# Altium schematic sheet CPU_POWER.SchDoc
size A2 portrait; SheetNumber: 18; SheetTotal: 25
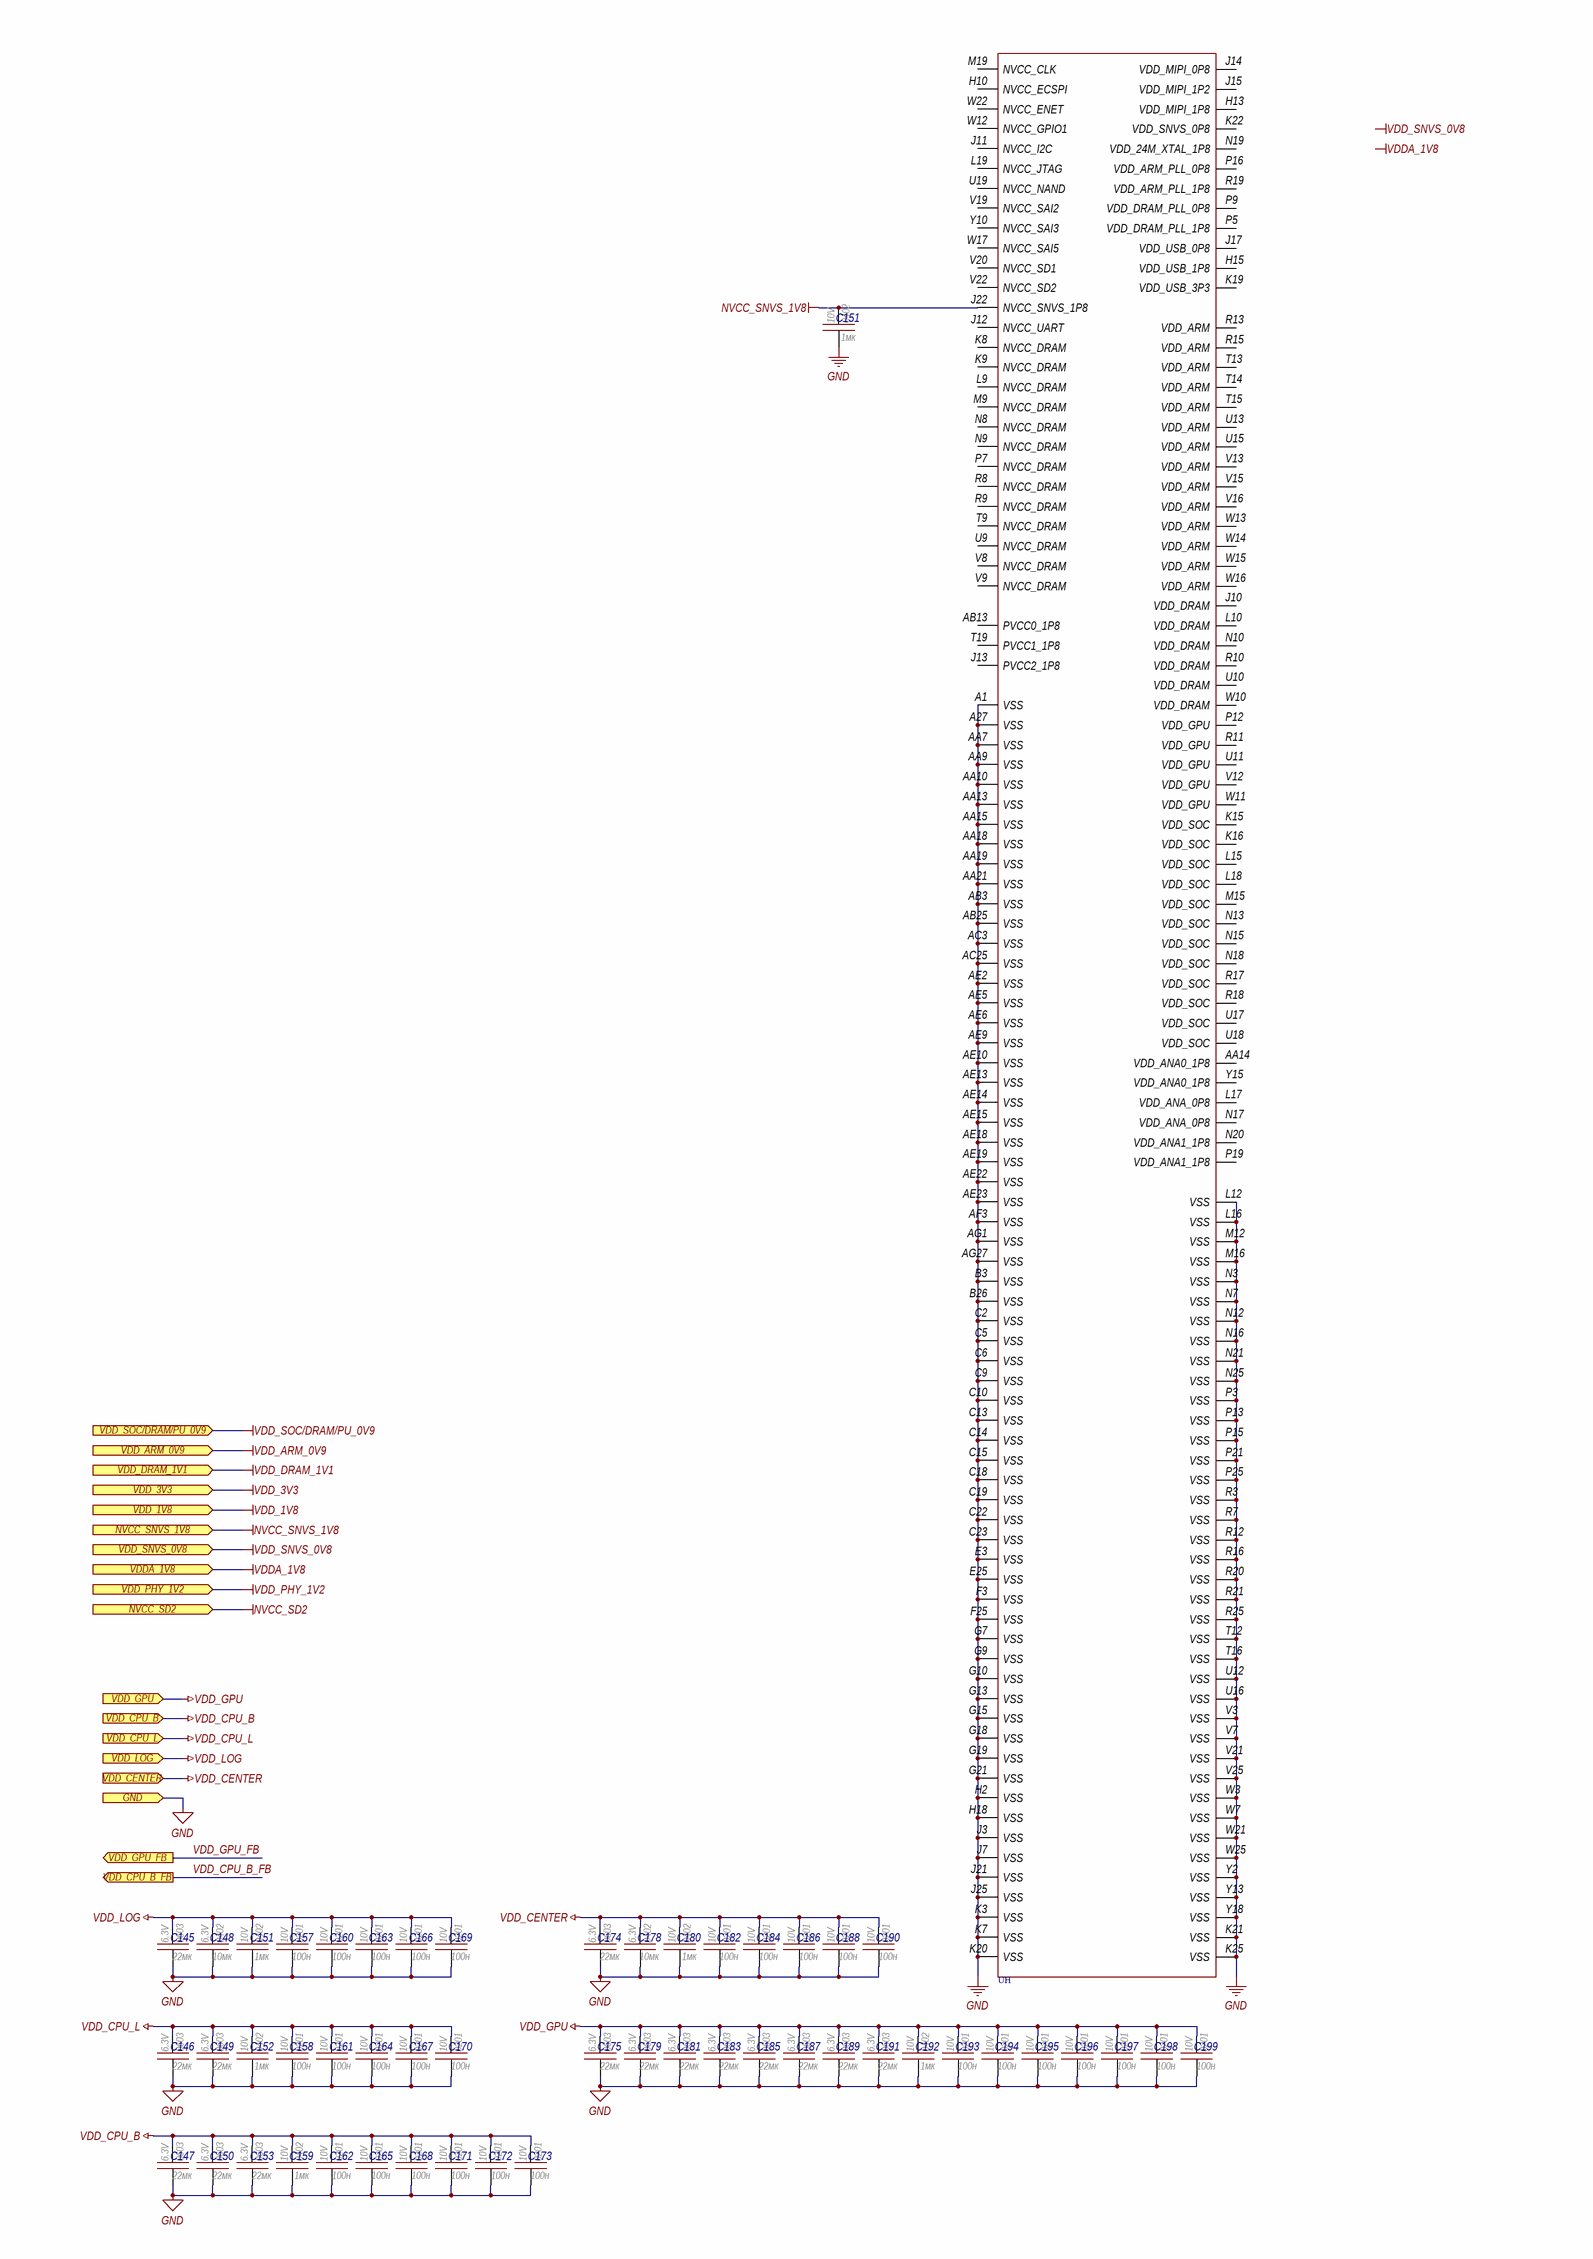
[diagram p0: CPU_POWER.SchDoc]

## Parts
(Parts that share a designator on the sheet are numbered #1, #2 ... from top to bottom, then left to right.)
C145  Значение: 22мк  2) Package: 0603  3) Voltage: 6.3V  [CAPC_1.8x1.0x1.0B_L]  (hidden comment: GRM188R60J226MEA0)
C146  Значение: 22мк  2) Package: 0603  3) Voltage: 6.3V  [CAPC_1.8x1.0x1.0B_L]  (hidden comment: GRM188R60J226MEA0)
C147  Значение: 22мк  2) Package: 0603  3) Voltage: 6.3V  [CAPC_1.8x1.0x1.0B_L]  (hidden comment: GRM188R60J226MEA0)
C148  Значение: 10мк  2) Package: 0402  3) Voltage: 6.3V  [CAPC_1.15x0.65x0.65B_L_Gap-0.25mm]  (hidden comment: GRM155R60J106ME15)
C149  Значение: 22мк  2) Package: 0603  3) Voltage: 6.3V  [CAPC_1.8x1.0x1.0B_L]  (hidden comment: GRM188R60J226MEA0)
C150  Значение: 22мк  2) Package: 0603  3) Voltage: 6.3V  [CAPC_1.8x1.0x1.0B_L]  (hidden comment: GRM188R60J226MEA0)
C151#1  Значение: 1мк  2) Package: 0402  3) Voltage: 10V  [CAPC_1.05x0.55x0.55B_N_SG-0.25_SE-0.05]  (hidden comment: GRM155R61A105KE15D)
C151#2  Значение: 1мк  2) Package: 0402  3) Voltage: 10V  [CAPC_1.05x0.55x0.55B_N_SG-0.25_SE-0.05]  (hidden comment: GRM155R61A105KE15D)
C152  Значение: 1мк  2) Package: 0402  3) Voltage: 10V  [CAPC_1.05x0.55x0.55B_N_SG-0.25_SE-0.05]  (hidden comment: GRM155R61A105KE15D)
C153  Значение: 22мк  2) Package: 0603  3) Voltage: 6.3V  [CAPC_1.8x1.0x1.0B_L]  (hidden comment: GRM188R60J226MEA0)
C157  Значение: 100н  2) Package: 0201  3) Voltage: 10V  [CAPC_0.63x0.33x0.33B_LL_SG-0.25_SE-0.05]  (hidden comment: GRM033R61A104KE15)
C158  Значение: 100н  2) Package: 0201  3) Voltage: 10V  [CAPC_0.63x0.33x0.33B_LL_SG-0.25_SE-0.05]  (hidden comment: GRM033R61A104KE15)
C159  Значение: 1мк  2) Package: 0402  3) Voltage: 10V  [CAPC_1.05x0.55x0.55B_N_SG-0.25_SE-0.05]  (hidden comment: GRM155R61A105KE15D)
C160  Значение: 100н  2) Package: 0201  3) Voltage: 10V  [CAPC_0.63x0.33x0.33B_LL_SG-0.25_SE-0.05]  (hidden comment: GRM033R61A104KE15)
C161  Значение: 100н  2) Package: 0201  3) Voltage: 10V  [CAPC_0.63x0.33x0.33B_LL_SG-0.25_SE-0.05]  (hidden comment: GRM033R61A104KE15)
C162  Значение: 100н  2) Package: 0201  3) Voltage: 10V  [CAPC_0.63x0.33x0.33B_LL_SG-0.25_SE-0.05]  (hidden comment: GRM033R61A104KE15)
C163  Значение: 100н  2) Package: 0201  3) Voltage: 10V  [CAPC_0.63x0.33x0.33B_LL_SG-0.25_SE-0.05]  (hidden comment: GRM033R61A104KE15)
C164  Значение: 100н  2) Package: 0201  3) Voltage: 10V  [CAPC_0.63x0.33x0.33B_LL_SG-0.25_SE-0.05]  (hidden comment: GRM033R61A104KE15)
C165  Значение: 100н  2) Package: 0201  3) Voltage: 10V  [CAPC_0.63x0.33x0.33B_LL_SG-0.25_SE-0.05]  (hidden comment: GRM033R61A104KE15)
C166  Значение: 100н  2) Package: 0201  3) Voltage: 10V  [CAPC_0.63x0.33x0.33B_LL_SG-0.25_SE-0.05]  (hidden comment: GRM033R61A104KE15)
C167  Значение: 100н  2) Package: 0201  3) Voltage: 10V  [CAPC_0.63x0.33x0.33B_LL_SG-0.25_SE-0.05]  (hidden comment: GRM033R61A104KE15)
C168  Значение: 100н  2) Package: 0201  3) Voltage: 10V  [CAPC_0.63x0.33x0.33B_LL_SG-0.25_SE-0.05]  (hidden comment: GRM033R61A104KE15)
C169  Значение: 100н  2) Package: 0201  3) Voltage: 10V  [CAPC_0.63x0.33x0.33B_LL_SG-0.25_SE-0.05]  (hidden comment: GRM033R61A104KE15)
C170  Значение: 100н  2) Package: 0201  3) Voltage: 10V  [CAPC_0.63x0.33x0.33B_LL_SG-0.25_SE-0.05]  (hidden comment: GRM033R61A104KE15)
C171  Значение: 100н  2) Package: 0201  3) Voltage: 10V  [CAPC_0.63x0.33x0.33B_LL_SG-0.25_SE-0.05]  (hidden comment: GRM033R61A104KE15)
C172  Значение: 100н  2) Package: 0201  3) Voltage: 10V  [CAPC_0.63x0.33x0.33B_LL_SG-0.25_SE-0.05]  (hidden comment: GRM033R61A104KE15)
C173  Значение: 100н  2) Package: 0201  3) Voltage: 10V  [CAPC_0.63x0.33x0.33B_LL_SG-0.25_SE-0.05]  (hidden comment: GRM033R61A104KE15)
C174  Значение: 22мк  2) Package: 0603  3) Voltage: 6.3V  [CAPC_1.8x1.0x1.0B_L]  (hidden comment: GRM188R60J226MEA0)
C175  Значение: 22мк  2) Package: 0603  3) Voltage: 6.3V  [CAPC_1.8x1.0x1.0B_L]  (hidden comment: GRM188R60J226MEA0)
C178  Значение: 10мк  2) Package: 0402  3) Voltage: 6.3V  [CAPC_1.15x0.65x0.65B_L_Gap-0.25mm]  (hidden comment: GRM155R60J106ME15)
C179  Значение: 22мк  2) Package: 0603  3) Voltage: 6.3V  [CAPC_1.8x1.0x1.0B_L]  (hidden comment: GRM188R60J226MEA0)
C180  Значение: 1мк  2) Package: 0402  3) Voltage: 10V  [CAPC_1.05x0.55x0.55B_N_SG-0.25_SE-0.05]  (hidden comment: GRM155R61A105KE15D)
C181  Значение: 22мк  2) Package: 0603  3) Voltage: 6.3V  [CAPC_1.8x1.0x1.0B_L]  (hidden comment: GRM188R60J226MEA0)
C182  Значение: 100н  2) Package: 0201  3) Voltage: 10V  [CAPC_0.63x0.33x0.33B_LL_SG-0.25_SE-0.05]  (hidden comment: GRM033R61A104KE15)
C183  Значение: 22мк  2) Package: 0603  3) Voltage: 6.3V  [CAPC_1.8x1.0x1.0B_L]  (hidden comment: GRM188R60J226MEA0)
C184  Значение: 100н  2) Package: 0201  3) Voltage: 10V  [CAPC_0.63x0.33x0.33B_LL_SG-0.25_SE-0.05]  (hidden comment: GRM033R61A104KE15)
C185  Значение: 22мк  2) Package: 0603  3) Voltage: 6.3V  [CAPC_1.8x1.0x1.0B_L]  (hidden comment: GRM188R60J226MEA0)
C186  Значение: 100н  2) Package: 0201  3) Voltage: 10V  [CAPC_0.63x0.33x0.33B_LL_SG-0.25_SE-0.05]  (hidden comment: GRM033R61A104KE15)
C187  Значение: 22мк  2) Package: 0603  3) Voltage: 6.3V  [CAPC_1.8x1.0x1.0B_L]  (hidden comment: GRM188R60J226MEA0)
C188  Значение: 100н  2) Package: 0201  3) Voltage: 10V  [CAPC_0.63x0.33x0.33B_LL_SG-0.25_SE-0.05]  (hidden comment: GRM033R61A104KE15)
C189  Значение: 22мк  2) Package: 0603  3) Voltage: 6.3V  [CAPC_1.8x1.0x1.0B_L]  (hidden comment: GRM188R60J226MEA0)
C190  Значение: 100н  2) Package: 0201  3) Voltage: 10V  [CAPC_0.63x0.33x0.33B_LL_SG-0.25_SE-0.05]  (hidden comment: GRM033R61A104KE15)
C191  Значение: 22мк  2) Package: 0603  3) Voltage: 6.3V  [CAPC_1.8x1.0x1.0B_L]  (hidden comment: GRM188R60J226MEA0)
C192  Значение: 1мк  2) Package: 0402  3) Voltage: 10V  [CAPC_1.05x0.55x0.55B_N_SG-0.25_SE-0.05]  (hidden comment: GRM155R61A105KE15D)
C193  Значение: 100н  2) Package: 0201  3) Voltage: 10V  [CAPC_0.63x0.33x0.33B_LL_SG-0.25_SE-0.05]  (hidden comment: GRM033R61A104KE15)
C194  Значение: 100н  2) Package: 0201  3) Voltage: 10V  [CAPC_0.63x0.33x0.33B_LL_SG-0.25_SE-0.05]  (hidden comment: GRM033R61A104KE15)
C195  Значение: 100н  2) Package: 0201  3) Voltage: 10V  [CAPC_0.63x0.33x0.33B_LL_SG-0.25_SE-0.05]  (hidden comment: GRM033R61A104KE15)
C196  Значение: 100н  2) Package: 0201  3) Voltage: 10V  [CAPC_0.63x0.33x0.33B_LL_SG-0.25_SE-0.05]  (hidden comment: GRM033R61A104KE15)
C197  Значение: 100н  2) Package: 0201  3) Voltage: 10V  [CAPC_0.63x0.33x0.33B_LL_SG-0.25_SE-0.05]  (hidden comment: GRM033R61A104KE15)
C198  Значение: 100н  2) Package: 0201  3) Voltage: 10V  [CAPC_0.63x0.33x0.33B_LL_SG-0.25_SE-0.05]  (hidden comment: GRM033R61A104KE15)
C199  Значение: 100н  2) Package: 0201  3) Voltage: 10V  [CAPC_0.63x0.33x0.33B_LL_SG-0.25_SE-0.05]  (hidden comment: GRM033R61A104KE15)
U  MIMX8MN6DVTJZAA  [486-BGA-NXP]  (value not drawn)  (part H of 8)

## Ports
GND (in), NVCC_SD2 (in), NVCC_SNVS_1V8 (in), VDD_1V8 (in), VDD_3V3 (in), VDD_ARM_0V9 (in), VDD_CENTER (in), VDD_CPU_B (in), VDD_CPU_B_FB (out), VDD_CPU_L (in), VDD_DRAM_1V1 (in), VDD_GPU (in), VDD_GPU_FB (out), VDD_LOG (in), VDD_PHY_1V2 (in), VDD_SNVS_0V8 (in), VDD_SOC/DRAM/PU_0V9 (in), VDDA_1V8 (in)

## Nets
GND: C145.2 C146.2 C147.2 C148.2 C149.2 C150.2 C151#1.2 C151#2.2 C152.2 C153.2 C157.2 C158.2 C159.2 C160.2 C161.2 C162.2 C163.2 C164.2 C165.2 C166.2 C167.2 C168.2 C169.2 C170.2 C171.2 C172.2 C173.2 C174.2 C175.2 C178.2 C179.2 C180.2 C181.2 C182.2 C183.2 C184.2 C185.2 C186.2 C187.2 C188.2 C189.2 C190.2 C191.2 C192.2 C193.2 C194.2 C195.2 C196.2 C197.2 C198.2 C199.2 U.A1(VSS) U.A27(VSS) U.AA7(VSS) U.AA9(VSS) U.AA10(VSS) U.AA13(VSS) U.AA15(VSS) U.AA18(VSS) U.AA19(VSS) U.AA21(VSS) U.AB3(VSS) U.AB25(VSS) U.AC3(VSS) U.AC25(VSS) U.AE2(VSS) U.AE5(VSS) U.AE6(VSS) U.AE9(VSS) U.AE10(VSS) U.AE13(VSS) U.AE14(VSS) U.AE15(VSS) U.AE18(VSS) U.AE19(VSS) U.AE22(VSS) U.AE23(VSS) U.AF3(VSS) U.AG1(VSS) U.AG27(VSS) U.B3(VSS) U.B26(VSS) U.C2(VSS) U.C5(VSS) U.C6(VSS) U.C9(VSS) U.C10(VSS) U.C13(VSS) U.C14(VSS) U.C15(VSS) U.C18(VSS) U.C19(VSS) U.C22(VSS) U.C23(VSS) U.E3(VSS) U.E25(VSS) U.F3(VSS) U.F25(VSS) U.G7(VSS) U.G9(VSS) U.G10(VSS) U.G13(VSS) U.G15(VSS) U.G18(VSS) U.G19(VSS) U.G21(VSS) U.H2(VSS) U.H18(VSS) U.J3(VSS) U.J7(VSS) U.J21(VSS) U.J25(VSS) U.K3(VSS) U.K7(VSS) U.K20(VSS) U.K21(VSS) U.K25(VSS) U.L12(VSS) U.L16(VSS) U.M12(VSS) U.M16(VSS) U.N3(VSS) U.N7(VSS) U.N12(VSS) U.N16(VSS) U.N21(VSS) U.N25(VSS) U.P3(VSS) U.P13(VSS) U.P15(VSS) U.P21(VSS) U.P25(VSS) U.R3(VSS) U.R7(VSS) U.R12(VSS) U.R16(VSS) U.R20(VSS) U.R21(VSS) U.R25(VSS) U.T12(VSS) U.T16(VSS) U.U12(VSS) U.U16(VSS) U.V3(VSS) U.V7(VSS) U.V21(VSS) U.V25(VSS) U.W3(VSS) U.W7(VSS) U.W21(VSS) U.W25(VSS) U.Y2(VSS) U.Y13(VSS) U.Y18(VSS) ; port GND
NVCC_SD2: port NVCC_SD2
NVCC_SNVS_1V8: C151#1.1 U.J22(NVCC_SNVS_1P8) ; port NVCC_SNVS_1V8
VDD_1V8: port VDD_1V8
VDD_3V3: port VDD_3V3
VDD_ARM_0V9: port VDD_ARM_0V9
VDD_CENTER: C174.1 C178.1 C180.1 C182.1 C184.1 C186.1 C188.1 C190.1 ; port VDD_CENTER
VDD_CPU_B: C147.1 C150.1 C153.1 C159.1 C162.1 C165.1 C168.1 C171.1 C172.1 C173.1 ; port VDD_CPU_B
VDD_CPU_L: C146.1 C149.1 C152.1 C158.1 C161.1 C164.1 C167.1 C170.1 ; port VDD_CPU_L
VDD_DRAM_1V1: port VDD_DRAM_1V1
VDD_GPU: C175.1 C179.1 C181.1 C183.1 C185.1 C187.1 C189.1 C191.1 C192.1 C193.1 C194.1 C195.1 C196.1 C197.1 C198.1 C199.1 ; port VDD_GPU
VDD_LOG: C145.1 C148.1 C151#2.1 C157.1 C160.1 C163.1 C166.1 C169.1 ; port VDD_LOG
VDD_PHY_1V2: port VDD_PHY_1V2
VDD_SNVS_0V8: port VDD_SNVS_0V8
VDD_SOC/DRAM/PU_0V9: port VDD_SOC/DRAM/PU_0V9
VDDA_1V8: port VDDA_1V8
VDD_CPU_B_FB: port VDD_CPU_B_FB
VDD_GPU_FB: port VDD_GPU_FB

Not connected (* = marked no-connect by the designer): U AA14(VDD_ANA0_1P8) AB13(PVCC0_1P8) H10(NVCC_ECSPI) H13(VDD_MIPI_1P8) H15(VDD_USB_1P8) J10(VDD_DRAM) J11(NVCC_I2C) J12(NVCC_UART) J13(PVCC2_1P8) J14(VDD_MIPI_0P8) J15(VDD_MIPI_1P2) J17(VDD_USB_0P8) K8(NVCC_DRAM) K9(NVCC_DRAM) K15(VDD_SOC) K16(VDD_SOC) K19(VDD_USB_3P3) K22(VDD_SNVS_0P8) L9(NVCC_DRAM) L10(VDD_DRAM) L15(VDD_SOC) L17(VDD_ANA_0P8) L18(VDD_SOC) L19(NVCC_JTAG) M9(NVCC_DRAM) M15(VDD_SOC) M19(NVCC_CLK) N8(NVCC_DRAM) N9(NVCC_DRAM) N10(VDD_DRAM) N13(VDD_SOC) N15(VDD_SOC) N17(VDD_ANA_0P8) N18(VDD_SOC) N19(VDD_24M_XTAL_1P8) N20(VDD_ANA1_1P8) P5(VDD_DRAM_PLL_1P8) P7(NVCC_DRAM) P9(VDD_DRAM_PLL_0P8) P12(VDD_GPU) P16(VDD_ARM_PLL_0P8) P19(VDD_ANA1_1P8) R8(NVCC_DRAM) R9(NVCC_DRAM) R10(VDD_DRAM) R11(VDD_GPU) R13(VDD_ARM) R15(VDD_ARM) R17(VDD_SOC) R18(VDD_SOC) R19(VDD_ARM_PLL_1P8) T9(NVCC_DRAM) T13(VDD_ARM) T14(VDD_ARM) T15(VDD_ARM) T19(PVCC1_1P8) U9(NVCC_DRAM) U10(VDD_DRAM) U11(VDD_GPU) U13(VDD_ARM) U15(VDD_ARM) U17(VDD_SOC) U18(VDD_SOC) U19(NVCC_NAND) V8(NVCC_DRAM) V9(NVCC_DRAM) V12(VDD_GPU) V13(VDD_ARM) V15(VDD_ARM) V16(VDD_ARM) V19(NVCC_SAI2) V20(NVCC_SD1) V22(NVCC_SD2) W10(VDD_DRAM) W11(VDD_GPU) W12(NVCC_GPIO1) W13(VDD_ARM) W14(VDD_ARM) W15(VDD_ARM) W16(VDD_ARM) W17(NVCC_SAI5) W22(NVCC_ENET) Y10(NVCC_SAI3) Y15(VDD_ANA0_1P8)

## Notes on the sheet
- Labels drawn without touching a wire or pin: VDD_SNVS_0V8, VDDA_1V8
- Подп. дата
- Инв. № дубл.
- Взам. инв. №
- Подп. и дата
- Инв. № подл.
- Изм.
- Лист
- № докум.
- Подп.
- Дата
- ALTIUM GOSTBOM2.0 KEV
- Файл:
- Копировал
- Формат А3

## Library data of the parts
C145-C147 C149 C150 C153 C174 C175 C179 C181 C183 C185 C187 C189 C191 = VCH_CMP_CAP_0000712-11: N/A; Manufacturer: Murata; Value: 22µF; 1) Ta max: 85°C; 1) Ta min: -55°C; 2) Height max: 1mm; 2) Length max: 1.8mm; 4) Dielectric: X5R; 4) Note: Derating1; 3) Tolerance [%]: 20%; 5) Application: General Purpose; Part Number: GRM188R60J226MEA0; 2) Width max: 1mm
C148 C178 = VCH_CMP_CAP_0000551-15: N/A; Manufacturer: Murata; Value: 10µF; 1) Ta max: 85°C; 1) Ta min: -55°C; 2) Height max: 650µm; 2) Length max: 1.15mm; 4) Dielectric: X5R; 4) Note: Derating1。 Only for mobile devices; 3) Tolerance [%]: 20%; 5) Application: General Purpose; Part Number: GRM155R60J106ME15; 2) Width max: 650µm
C151#1 C151#2 C152 C159 C180 C192 = VCH_CMP_CAP_0000895-13: N/A; Manufacturer: Murata; Value: 1µF; 1) Ta max: 85°C; 1) Ta min: -55°C; 2) Height max: 550µm; 2) Length max: 1.05mm; 4) Dielectric: X5R; 3) Tolerance [%]: 10%; 5) Application: General Purpose; Part Number: GRM155R61A105KE15D; 2) Width max: 550µm; 4) Note: N/A
C157 C158 C160-C173 C182 C184 C186 C188 C190 C193-C199 = VCH_CMP_CAP_0000132-25: N/A; Manufacturer: Murata; Value: 100nF; 1) Ta max: 85°C; 1) Ta min: -55°C; 2) Height max: 330µm; 2) Length max: 630µm; 4) Dielectric: X5R; 3) Tolerance [%]: 10%; 5) Application: General Purpose; Part Number: GRM033R61A104KE15; 2) Width max: 330µm; 4) Note: N/A
U = MIMX8MN6DVTJZAA: ARMÂ® CortexÂ®-A53 Microprocessor IC i.MX8MN 4 Core, 32-Bit 1.5GHz 486-LFBGA (14x14); Manufacture: NXP USA Inc.; Package: LFBGA-486 NXP USA Inc.; Mouser-Purchase-URL: https://snapeda.com/shop?store=Mouser&id=4467530; Availability: Warning; MP: MIMX8MN6DVTJZAA; SnapEDA_Link: https://www.snapeda.com/parts/MIMX8MN6DVTJZAA/NXP%20Semiconductors/view-part/4467530/?ref=snap; Value: *; Arrow_Electronics-Purchase-URL: https://snapeda.com/shop?store=Arrow+Electronics&id=4467530; BuyPart: https://www.snapeda.com/parts/MIMX8MN6DVTJZAA/NXP%20Semiconductors/view-part/4467530/?ref=eda